# Altium schematic sheet Sheet1.SchDoc
size A4; ENG_APP_DATE: --/--/--; DSN_APP_DATE: --/--/--; CHK_APP_DATE: --/--/--; SheetNumber: 1; SheetTotal: 1
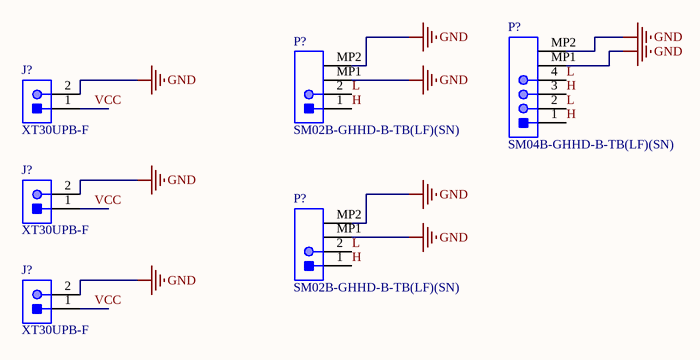
[diagram p0: Sheet1.SchDoc]

## Parts
(Parts that share a designator on the sheet are numbered #1, #2 ... from top to bottom, then left to right.)
J?#1  XT30UPB-F  [AMASS-XT30UPB-F]
J?#2  XT30UPB-F  [AMASS-XT30UPB-F]
J?#3  XT30UPB-F  [AMASS-XT30UPB-F]
P?#1  SM02B-GHHD-B-TB(LF)(SN)  [JST-SM02B-GHS-TB_V]
P?#2  SM04B-GHHD-B-TB(LF)(SN)  [JST-SM04B-GHS-TB_V]
P?#3  SM02B-GHHD-B-TB(LF)(SN)  [JST-SM02B-GHS-TB_V]

## Nets
GND: J?#1.2 J?#2.2 J?#3.2 P?#1.MP1 P?#1.MP2 P?#2.MP1 P?#2.MP2 P?#3.MP1 P?#3.MP2
H: P?#1.1 P?#2.1 P?#2.3 P?#3.1
L: P?#1.2 P?#2.2 P?#2.4 P?#3.2
VCC: J?#1.1 J?#2.1 J?#3.1

## Notes on the sheet
- MacFalcons - McMaster University

## Library data of the parts
J?#1-J?#3 = CMP-002-00125-1: XT Series Lithium Battery Female Connector, 2-pin TH; Manufacturer: AMASS; Design Item ID: XT30UPB-F; Part Number: XT30UPB-F; Publisher: Bolgen Studio; Manufacturer URL: http://www.china-amass.com; Source: Changzhou Amass Lithium Battery Connector.SchLib
P?#1 P?#3 = CMP-010-000034-1: GH Disconnectable Crimp Style Connector, Pitch 1.25 mm, 1 x 2 Position, Height 4.25 mm, -25 to 85 degC, RoHS, Tape and Reel; Manufacturer: JST; Pitch: 1.25mm; No of Positions: 2; Style/Orientation: RightAngleHeader/Plug; Termination: Crimp; Manufacturer URL: http://www.jst.com/home2.html; Source: JST GH connector.SchLib; Type: WiretoBoard; Datasheet URL: http://www.jst-mfg.com/product/pdf/eng/eGH.pdf; Package Description: GH Disconnectable Crimp Style Connector, Pitch 1.25 mm, 1 x 2 Position, Height 4.25 mm; Mounting Technology: SurfaceMount; Design Item ID: SM02B-GHHD-B-TB(LF)(SN); Package Reference: SM02B-GHS-TB; Datasheet Version: 05/2016
P?#2 = CMP-010-000035-1: GH Disconnectable Crimp Style Connector, Pitch 1.25 mm, 1 x 4 Position, Height 4.25 mm, -25 to 85 degC, RoHS, Tape and Reel; Manufacturer: JST; Style/Orientation: RightAngleHeader/Plug; Pitch: 1.25mm; No of Positions: 4; Source: JST GH connector.SchLib; Type: WiretoBoard; Manufacturer URL: http://www.jst.com/home2.html; Design Item ID: SM04B-GHHD-B-TB(LF)(SN); Package Reference: SM04B-GHS-TB; Package Description: GH Disconnectable Crimp Style Connector, Pitch 1.25 mm, 1 x 4 Position, Height 4.25 mm; Mounting Technology: SurfaceMount; Datasheet URL: http://www.jst-mfg.com/product/pdf/eng/eGH.pdf; Termination: Crimp; Datasheet Version: 05/2016